# EAGLE design gelh (EAGLE 6.5.0)
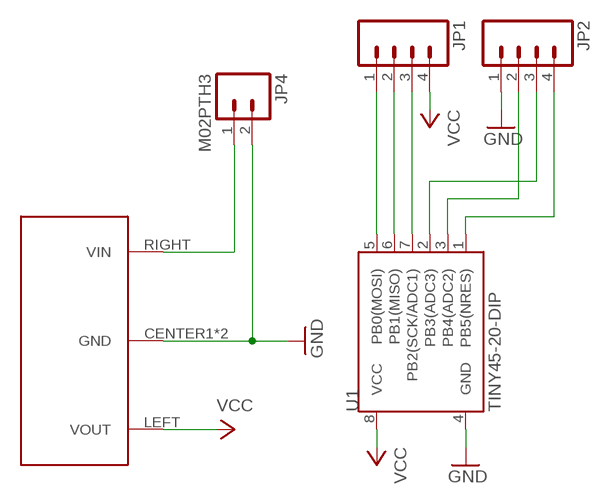
[diagram p0: schematic, sheet 1]

## Parts
JP1  M04LONGPADS  [1X04_LONGPADS]
JP2  M04LONGPADS  [1X04_LONGPADS]
JP4  M02PTH3  [1X02_LONGPADS]
U1  TINY45-20-DIP  ATTINY45TINY45-20-DIP  [DIP08]
U$1  78L05  [SOT89]

## Nets
GND: JP2.1 JP4.2 U1.4(GND) U$1.CENTER1(GND) U$1.CENTER2(GND)
N$1: JP4.1 U$1.RIGHT(VIN)
N$2: JP1.1 U1.5(PB0(MOSI))
N$3: JP1.2 U1.6(PB1(MISO))
N$4: JP2.4 U1.1(PB5(NRES))
N$5: JP2.3 U1.2(PB3(ADC3))
N$6: JP2.2 U1.3(PB4(ADC2))
N$7: JP1.3 U1.7(PB2(SCK/ADC1))
VCC: JP1.4 U1.8(VCC) U$1.LEFT(VOUT)

## Library data of the parts
JP1 JP2 = SparkFun-Connectors:M04: Header 4 Standard 4-pin 0.1" header. Use with straight break away headers (SKU : PRT-00116), right angle break away headers (PRT-00553), swiss pins (PRT-00743), machine pins (PRT-00117), and female headers (PRT-00115). Molex polarized connector foot print use with SKU : PRT-08231 with associated crimp pins and housings. 1MM SMD Version SKU: PRT-10208
JP4 = SparkFun-Connectors:M02: Standard 2-pin 0.1" header. Use with - straight break away headers ( PRT-00116) - right angle break away headers (PRT-00553) - swiss pins (PRT-00743) - machine pins (PRT-00117) - female headers (PRT-00115) Molex polarized connector foot print use with: PRT-08233 with associated crimp pins and housings. 2.54_SCREWTERM for use with PRT-10571. 3.5mm Screw Terminal footprints for PRT-08084 5mm Screw Terminal footprints for use with PRT-08433
U1 = SparkFun-DigitalIC:ATTINY45: Atmel 8-pin 2/4/8kB flash uC; PROD_ID: IC-09439
U$1 = bts:78L05

## Board
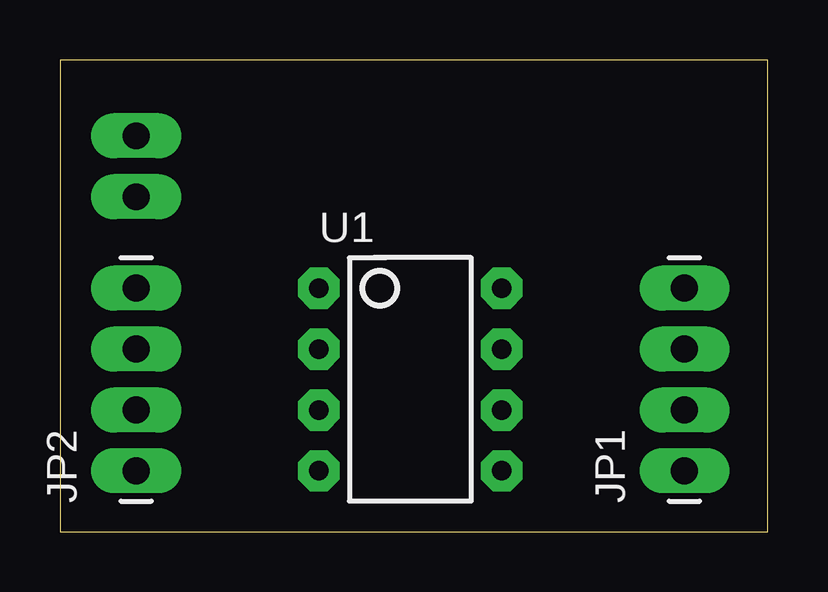
[diagram p1: board, top side]
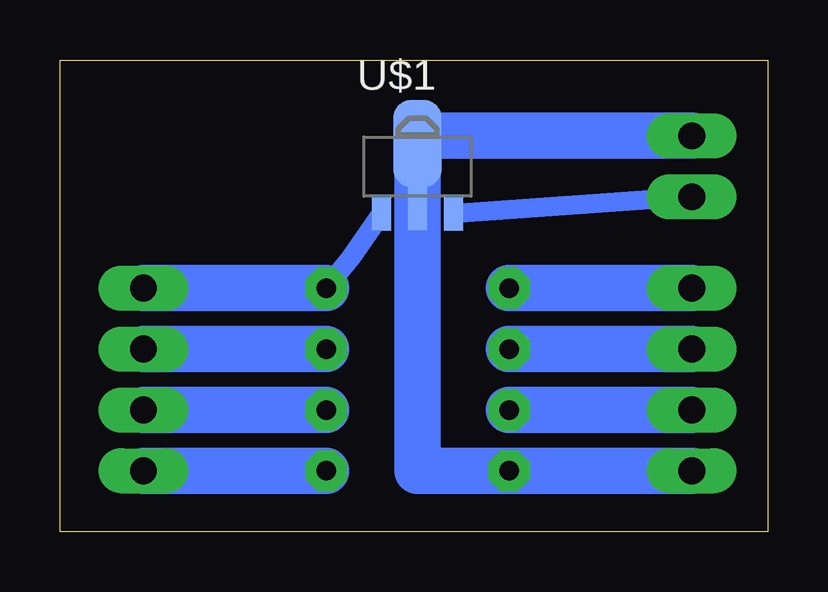
[diagram p2: board, bottom side, seen from below]

Size 29.52 x 19.68 mm. Coordinates in mm from the lower left corner, seen from the top.
Outline: 0,0 29.52,0 29.52,19.68 0,19.68 0,0
Copper layers (1*16): Top 0.035mm / dielectric 1.5mm / Bottom 0.035mm
Design rules "default": minimum track width 10mil, minimum drill 24mil, track to track 8mil, track to pad 8mil, pad to pad 8mil, via to via 8mil, smd to smd 8mil, copper to edge 40mil, drill to drill 8mil, minimum pad ring 10mil, minimum via ring 8mil, stop-mask expansion 4mil, vias tented up to drill 0mil, thermal gap 10mil

### Footprints (pad centres in the part's own frame; a part is rotated, then mirrored left to right if it is on the bottom)
1X04_LONGPADS = drill 1.118 pad 1.88 long: 1 0,0; 2 2.54,0; 3 5.08,0; 4 7.62,0
1X02_LONGPADS = drill 1.118 pad 1.88 long: 1 0,0; 2 2.54,0
DIP08 = drill 0.813 pad 1.727 octagon: 1 -3.81,-3.81; 2 -1.27,-3.81; 3 1.27,-3.81; 4 3.81,-3.81; 5 3.81,3.81; 6 1.27,3.81; 7 -1.27,3.81; 8 -3.81,3.81
SOT89 = smd 0.8 x 1.9: CENTER1 0,-1.727 | smd 2.032 x 3.65: CENTER2 0,0.94 | smd 0.8 x 1.4: LEFT -1.499,-1.981; RIGHT 1.499,-1.981

### Placement (x,y rotation side)
JP1  26.04,2.54 90 top
JP2  3.17,2.54 90 top
JP4  3.17,13.97 90 top
U1  14.61,6.35 270 top
U$1  14.61,15.24 0 bottom

### Tracks (layer width: path | path; a pad name or v marks a point on that pad's centre or on a via)
GND
  Bottom 1.93: JP2.1 U1.4 14.61,2.54 U$1.CENTER1 U$1.CENTER2 14.61,16.51 JP4.2
N$1
  Bottom 0.813: U$1.RIGHT JP4.1
N$2
  Bottom 1.93: U1.5 JP1.1
N$3
  Bottom 1.93: U1.6 JP1.2
N$4
  Bottom 1.93: U1.1 JP2.4
N$5
  Bottom 1.93: U1.2 JP2.3
N$6
  Bottom 1.93: U1.3 JP2.2
N$7
  Bottom 1.93: U1.7 JP1.3
VCC
  Bottom 0.813: U1.8 17.37,11.43 U$1.LEFT
  Bottom 1.93: U1.8 JP1.4